# Altium schematic sheet Sheet1.SchDoc
size A4
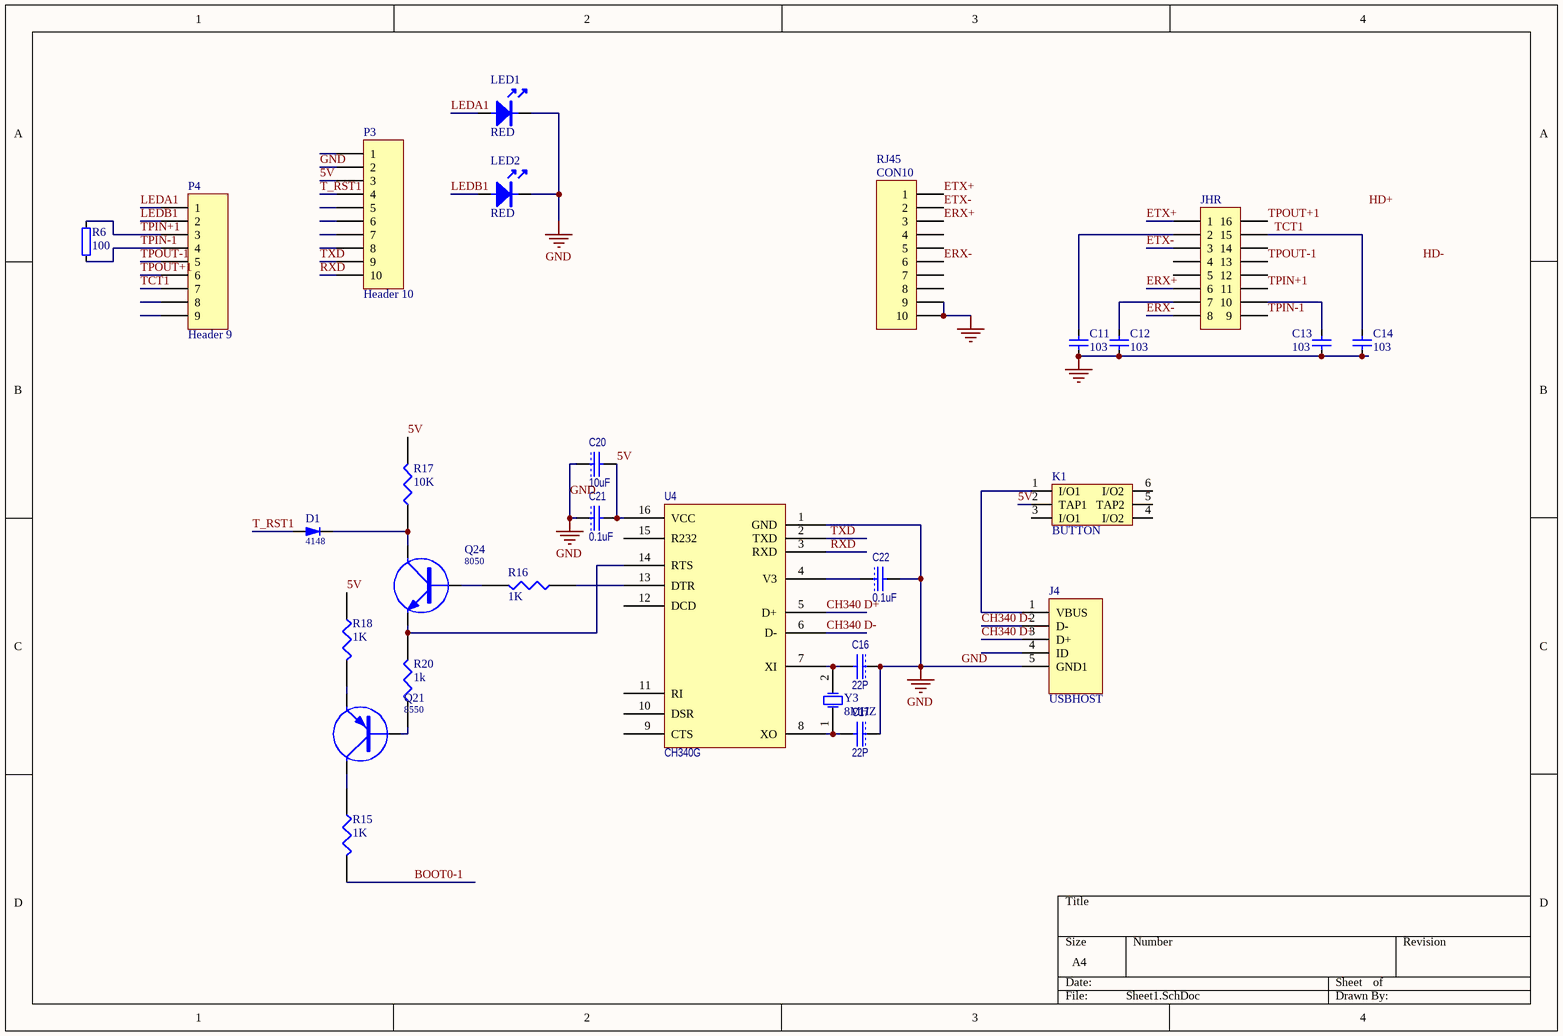
[diagram p0: Sheet1.SchDoc]

## Parts
C11  103  [C1]
C12  103  [C1]
C13  103  [0805]
C14  103  [0805]
C16  22P  [0805]
C17  22P  [0805]
C20  10uF  [0805]
C21  0.1uF  [0805]
C22  0.1uF  [0805]
D1  4148  [4148]
J4  USBHOST  [USB]
JHR  (no value)  [SMD-16B]
K1  BUTTON  [BTN8.5*8.5]
LED1  RED  [LED0805]
LED2  RED  [LED0805]
P3  Header 10  [HDR1X10]
P4  Header 9  [HDR1X9]
Q21  8550  [PNP-8550]
Q24  8050  [NPN-8050]
R6  100  [0805]
R15  1K  [0805]
R16  1K  [0805]
R17  10K  [0805]
R18  1K  [0805]
R20  1k  [0805]
RJ45  CON10  [RJ45]
U4  CH340G  [SO16]
Y3  8MHZ  [XTAL_24M]

## Nets
GND: C11.2 C12.2 C13.1 C14.2 C16.1 C17.1 C20.1 C21.1 C22.2 J4.0(GND1) J4.5(GND1) LED1.2 LED2.2 P3.2 RJ45.9 RJ45.10 U4.1(GND)
5V: C20.2 C21.2 K1.2(TAP1) P3.3 R17.2 R18.1 U4.16(VCC)
BOOT0-1: R15.2
CH340 D+: J4.3(D+) U4.5(D+)
CH340 D-: J4.2(D-) U4.6(D-)
ERX+: JHR.6 RJ45.3
ERX-: JHR.8 RJ45.6
ETX+: JHR.1 RJ45.1
ETX-: JHR.3 RJ45.2
LEDA1: LED1.1 P4.1
LEDB1: LED2.1 P4.2
RXD: P3.10 U4.3(RXD)
T_RST1: D1.1 P3.4
TCT1: C14.1 JHR.15 P4.7
TPIN+1: JHR.11 P4.3 R6.2
TPIN-1: JHR.9 P4.4 R6.1
TPOUT+1: JHR.16 P4.6
TPOUT-1: JHR.13 P4.5
TXD: P3.9 U4.2(TXD)
NetC11_1: C11.1 JHR.2
NetC12_1: C12.1 JHR.7
NetC13_2: C13.2 JHR.10
NetC16_2: C16.2 U4.7(XI) Y3.2(OSC2)
NetC17_2: C17.2 U4.8(XO) Y3.1(OSC1)
NetC22_1: C22.1 U4.4(V3)
NetD1_2: D1.2 Q24.C R17.1
NetJ4_1: J4.1(VBUS) K1.1(I/O1)
NetQ21_B: Q21.B R20.1
NetQ21_C: Q21.C R15.1
NetQ21_E: Q21.E R18.2
NetQ24_B: Q24.B R16.2
NetQ24_E: Q24.E R20.2 U4.14(RTS)
NetR16_1: R16.1 U4.13(DTR)

Not connected (* = marked no-connect by the designer): J4 4(ID); JHR 4 5 12 14; K1 3(I/O1) 4(I/O2) 5(TAP2) 6(I/O2); P3 1 5 6 7 8; P4 8 9; RJ45 4 5 7 8; U4 9(CTS) 10(DSR) 11(RI) 12(DCD) 15(R232)

## Notes on the sheet
- Labels drawn without touching a wire or pin: HD+, HD-

## Library data of the parts
C11-C14 = CAP
C16 C17 C20-C22 = CAP: Capacitor
D1 = DIODE
J4 = USBHOST: J4
JHR = CON16: Connector
LED1 LED2 = LED85YEL: Yellow LED; Manufacturer: Everlight; Part Number: LED85YEL
P3 = Header 10: Header, 10-Pin; LatestRevisionDate: 17-Jul-2002; LatestRevisionNote: Re-released for DXP Platform.; Publisher: Altium Limited
P4 = Header 9: Header, 9-Pin; LatestRevisionDate: 17-Jul-2002; LatestRevisionNote: Re-released for DXP Platform.; Publisher: Altium Limited
Q21 = PNP
Q24 = NPN
R6 = RES2
R15-R18 R20 = RES1
RJ45 = CON10: Connector
U4 = MAX3232: Text Field1: 90; Text Field2: 190
Y3 = XTAL: Crystal Oscillator; Published: 8-Jun-2000; LatestRevisionDate: 17-Jul-2002; LatestRevisionNote: Re-released for DXP Platform.; PackageReference: R38; Publisher: Altium Limited